# Altium schematic sheet Sheet.SchDoc
size A4; SheetNumber: 1; SheetTotal: 1
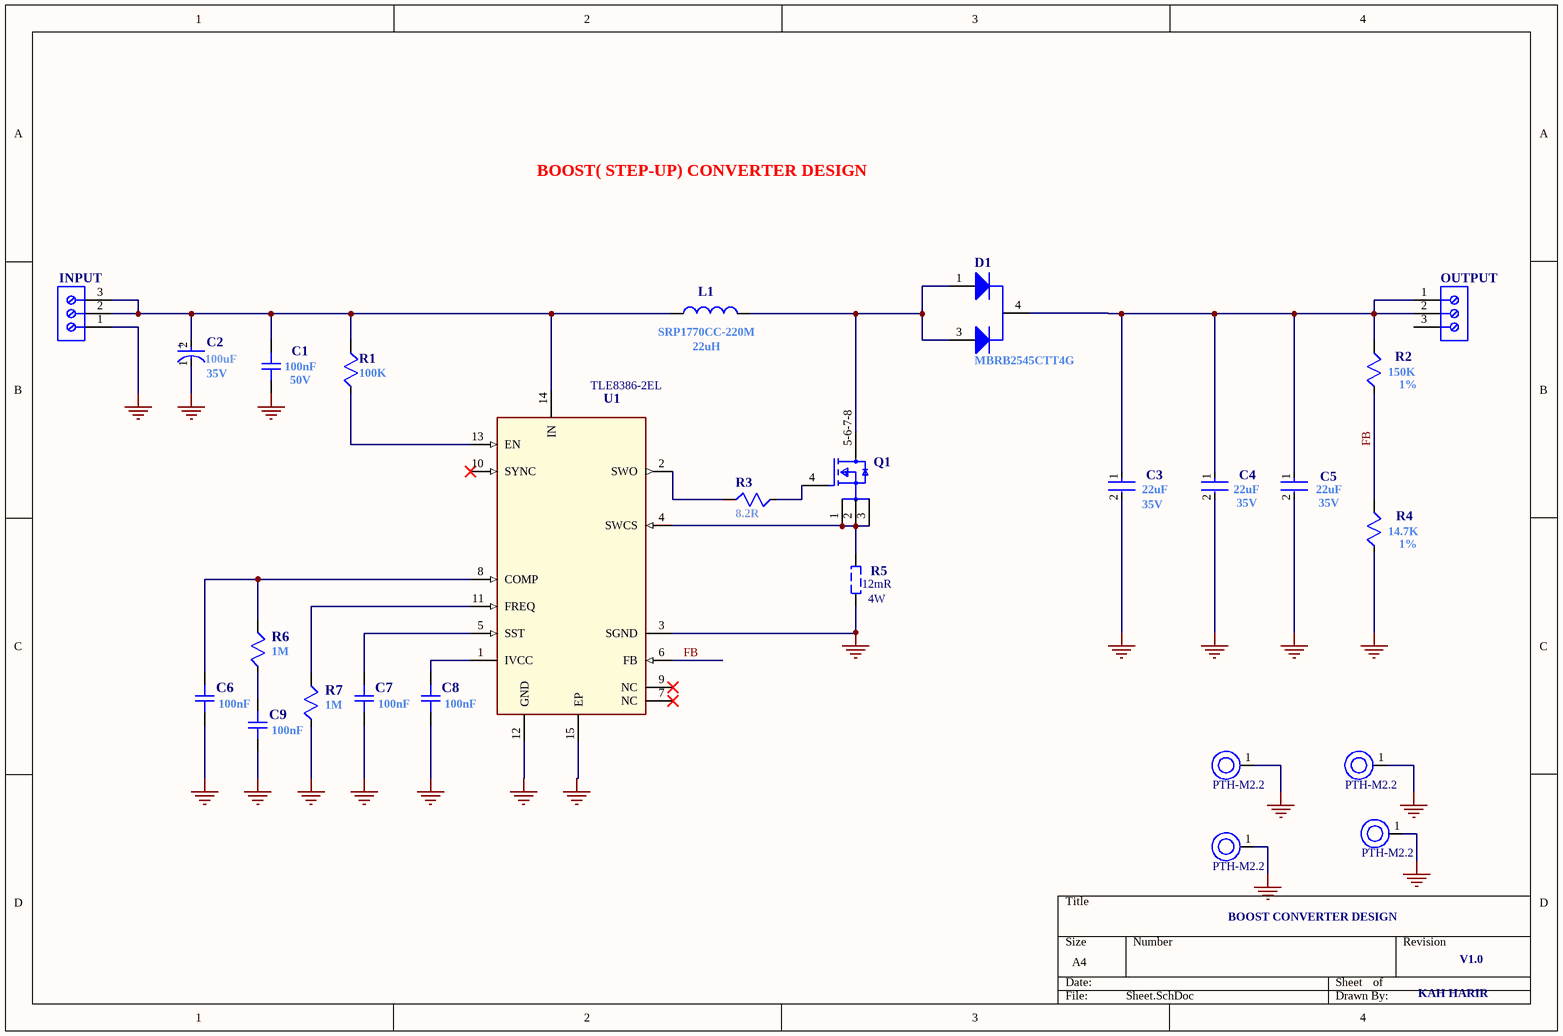
[diagram p0: Sheet.SchDoc]

## Parts
C1  value 100nF  Rating: 50V  [CAP_0603]  (hidden comment: CC0603KRX7R9BB104)
C2  Capacitance: 100uF  Voltage: 35V  [FP-FPF-MFG]  (hidden comment: EEE-FP1V101AP)
C3  Voltage: 35V  Capacitance: 22uF  [FP-C3216-160-0_2-IPC_B]  (hidden comment: C3216X5R1V226M160AC)
C4  Voltage: 35V  Capacitance: 22uF  [FP-C3216-160-0_2-IPC_B]  (hidden comment: C3216X5R1V226M160AC)
C5  Voltage: 35V  Capacitance: 22uF  [FP-C3216-160-0_2-IPC_B]  (hidden comment: C3216X5R1V226M160AC)
C6  value 100nF  [CAP_0603]  (hidden comment: CC0603KRX7R9BB104)
C7  value 100nF  [CAP_0603]  (hidden comment: CC0603KRX7R9BB104)
C8  value 100nF  [CAP_0603]  (hidden comment: CC0603KRX7R9BB104)
C9  value 100nF  [CAP_0603]  (hidden comment: CC0603KRX7R9BB104)
D1  MBRB2545CTT4G  [ONSC-D2PAK-3-418B-04_V]
INPUT  691102710003  [691102710003]  (value not drawn)
L1  SRP1770CC-220M  value 22uH  [SRP1770TA]
OUTPUT  691102710003  [691102710003]  (value not drawn)
PTH1  PTH-M2.2  [PH3.2]
PTH2  PTH-M2.2  [PH3.2]
PTH3  PTH-M2.2  [PH3.2]
PTH4  PTH-M2.2  [PH3.2]
Q1  BSC028N06NSTATMA1  [FP-PG-TDSON-8-MFG]  (value not drawn)
R1  100K  [RESC1608N]
R2  150K  value 1%  [RESC1608N]
R3  8.2R  [RESC1608N]
R4  14.7K  value 1%  [RESC1608N]
R5  value 12mR  Rate: 4W  [CSS2H-2512]  (hidden comment: CMS-R010-1.0)
R6  1M  [RESC1608N]
R7  1M  [RESC1608N]
U1  TLE8386-2EL  [SOP65P600X170-15N]

## Nets
GND: C1.1 C2.1(C) C3.2 C4.2 C5.2 C6.1 C7.1 C8.1 C9.1 INPUT.1 PTH1.1 PTH2.1 PTH3.1 PTH4.1 R4.1 R5.2 R7.1 U1.3(SGND) U1.12(GND) U1.15(EP)
FB: R2.1 R4.2 U1.6(FB)
NetC1_2: C1.2 C2.2(A) INPUT.2 INPUT.3 L1.1 R1.2 U1.14(IN)
NetC3_1: C3.1 C4.1 C5.1 D1.4(K) OUTPUT.1 OUTPUT.2 R2.2
NetC6_2: C6.2 R6.2 U1.8(COMP)
NetC7_2: C7.2 U1.5(SST)
NetC8_2: C8.2 U1.1(IVCC)
NetC9_2: C9.2 R6.1
NetD1_1: D1.1(A1) D1.3(A2) L1.2 Q1.5-6-7-8(D)
NetQ1_1: Q1.1(S) Q1.2(S) Q1.3(S) R5.1 U1.4(SWCS)
NetQ1_4: Q1.4(G) R3.1
NetR1_1: R1.1 U1.13(EN)
NetR3_2: R3.2 U1.2(SWO)
NetR7_2: R7.2 U1.11(FREQ)

Not connected (* = marked no-connect by the designer): OUTPUT 3; U1 7(NC)* 9(NC)* 10(SYNC)*

## Notes on the sheet
- BOOST( STEP-UP) CONVERTER DESIGN
- BOOST CONVERTER DESIGN
- V1.0
- KAH HARIR
- (in symbol CMP-05427-000034-1) +

## Library data of the parts
C1 C6-C9 = CAP_0603: 0.1 µF ±10% 50V Ceramic Capacitor X7R 0603 (1608 Metric); Manufacturer: YAGEO; Manufacturer Part Number: CC0603KRX7R9BB104; Distributor Link: https://www.digikey.com/en/products/detail/yageo/CC0603KRX7R9BB104/2103082?gclsrc=aw.ds&gad_source=1&gad_campaignid=21513785267&gbraid=0AAAAADrbLljzI6fa-Yv3A_zcN2QMoABTo&gclid=Cj0KCQjw267GBhCSARIsAOjVJ4GgA4ff2FxiLCEbH8-vZcEXf5Wzezs6PVganFd4XNuEUpgWgdMcZi8aAmI2EALw_wcB; LCSC: X7R; Dielectric: *; Supplier 1: Farnell; Supplier Part Number 1: 1362556
  C6-C9: Rating: 50V
C2 = CMP-05427-000034-1: CAP ALUM 100UF 20% 35V SMD; ESR (Equivalent Series Resistance): 80mR; Dielectric Material: Aluminium; Ripple Current (AC): 850mA; Leakage Current: 35uA; Life (Hours): 2000Hour; Radiation Hardening: No; Length: 10.5mm; Max Operating Temperature: 105°C; Number of Pins: 2; Contact Plating: Tin; Voltage Rating (DC): 35V; Width: 8.3mm; Voltage Rating: 35V; Termination: SMD/SMT; Mount: Surface Mount; Min Operating Temperature: -55°C; Height - Seated (Max): 0.402inch; Lead Pitch: 3.1mm; Series: FP; Height: 10.2mm; Construction: Cylindrical; Diameter: 8mm; RoHS Compliant: Yes; Package Quantity: 1; Material: Aluminium; Packaging: Tape and Reel; Lead Free: Lead Free; REACH SVHC: No SVHC; Ripple Current: 850mA; Case/Package: Radial; Tolerance: 20%
C3-C5 = CMP-2000-05398-2: Multilayer Ceramic Capacitors 22uF ±20% 35V X5R SMD 1206; Mount: Surface Mount; Voltage Rating: 35V; Length: 3.2mm; Case/Package: 1206; Width: 0.063inch; Dielectric Material: Ceramic; Series: C; Voltage Rating (DC): 35V; Construction: Flat; Tolerance: 20%; Dielectric: X5R; Min Operating Temperature: -55°C; Case Code (Metric): 3216; Termination: SMD/SMT; Resistor Type: Ceramic; RoHS Compliant: Yes; Height: 1.6mm; Depth: 1.6mm; Radiation Hardening: No; Package Quantity: 2000; REACH SVHC: No SVHC; Case Code (Imperial): 1206; Weight: 0.000571oz; Max Operating Temperature: 85°C; Packaging: Tape and Reel; Thickness: 1.6mm; Lead Free: Lead Free
D1 = CMP-1055-00101-1: SWITCHMODE(TM) Power Rectifier, 3-Pin D2PAK, Pb-Free, Tape and Reel; Manufacturer: On Semiconductor; IFSM Max (A): 150; Configuration: Common Cathode; ComponentLink1URL: http://www.onsemi.com/; ComponentLink3URL: http://www.onsemi.com/pub_link/Collateral/418B-04.PDF; Packing: Tape and Reel; ComponentLink2Description: Datasheet; DatasheetVersion: Rev. 12; PackageDescription: 3-Pin Flange Mount, Body 9.145 x 9.97 mm, Pitch 2.54 mm; Mounting Technology: Surface Mount; ComponentLink1Description: Manufacturer URL; ComponentLink3Description: Package Specification; RoHS: TRUE; ComponentLink2URL: http://www.onsemi.cn/pub_link/Collateral/MBRB2545CT-D.PDF; PackageVersion: Rev. K, 09/2008; PartNumber: MBRB2545CTT4G; PackageReference: D2PAK-3-418B-04
INPUT OUTPUT = CMP-1502-03259-3: 102 Series 5MM Pitch Straight, Pcb Terminal Block, Through Hole, 3 Way; Current: 15A; Wire Gauge (Max): 22AWG; Voltage: 300V; Number of Contacts: 3; Plating: Steel; Number of Levels: 1; Stripping Length: -6mm; Wire Gauge (Min): 14AWG; Pitch: 5.0038mm; Contact Plating: Tin; Wire/Cable Gauge: 22AWG; Number of Positions Per Level: 3; Min Operating Temperature: -40°C; Housing Material: Nylon; Length: 7.5mm; Contact Material: Brass; RoHS: Compliant; Max Operating Temperature: 105°C; Voltage Rating: 300V; Number of Pins: 3; Current Rating: 15A; Packaging: Box; Termination: Screw; Lead Pitch: 5mm; Color: Blue; Width: 16.2mm; Mount: Through Hole; Height: 13.4mm
L1 = SRP1770TA-1R0M: 1 ÂµH Shielded Drum Core, Wirewound Inductor 52 A 2mOhm Max Nonstandard; MF: Bourns; Package: NONSTANDARD-2 BOURNS; Price: None; Check_prices: https://www.snapeda.com/parts/SRP1770TA-1R0M/Bourns/view-part/?ref=eda; SnapEDA_Link: https://www.snapeda.com/parts/SRP1770TA-1R0M/Bourns/view-part/?ref=snap; MP: SRP1770TA-1R0M; Availability: In Stock; Purchase-URL: https://pricing.snapeda.com/search?q=SRP1770TA-1R0M&ref=eda
PTH1-PTH4 = PTH_S1
Q1 = CMP-32901-000649-1: MOSFET N-CH 60V 24A/100A TDSON; Rds On Max: 2.8mR; Max Power Dissipation: 100W; Continuous Drain Current (ID): 100A; Input Capacitance: 3.375nF; RoHS Compliant: Yes; Min Operating Temperature: -55°C; Max Operating Temperature: 175°C; Packaging: Tape and Reel; Drain to Source Voltage (Vdss): 60V; Number of Pins: 8; Mount: Surface Mount
R1-R4 R6 R7 = RES_2A: 0.1W, 1/10W Chip Resistor 0603 (1608 Metric)
  R1 R3 R6 R7: Value: *
R5 = CSS2H-2512: RES.SHUNT (6432) 2512 10m Ohms 1% 2.5W AUTO SMT; Manufacturer: ISABELLENHÜTTE; Manufacturer Part Number: CMS-R010-1.0; ComponentLink1Description: Product link Vender; ComponentLink1URL: https://www.ozdisan.com/p/hassas-ve-sont-direncler-195/isabellenhutte-cms-r010-1-0-536275
U1 = TLE8386-2EL: Basic Smart Boost Controller; Manufacturer: Infineon Technologies; ManufacturerPartNumber: TLE8386-2EL; PackageReference: PG-SSOP-14-3